# EAGLE schematic Digital-Transmitter (EAGLE 8.5.2)
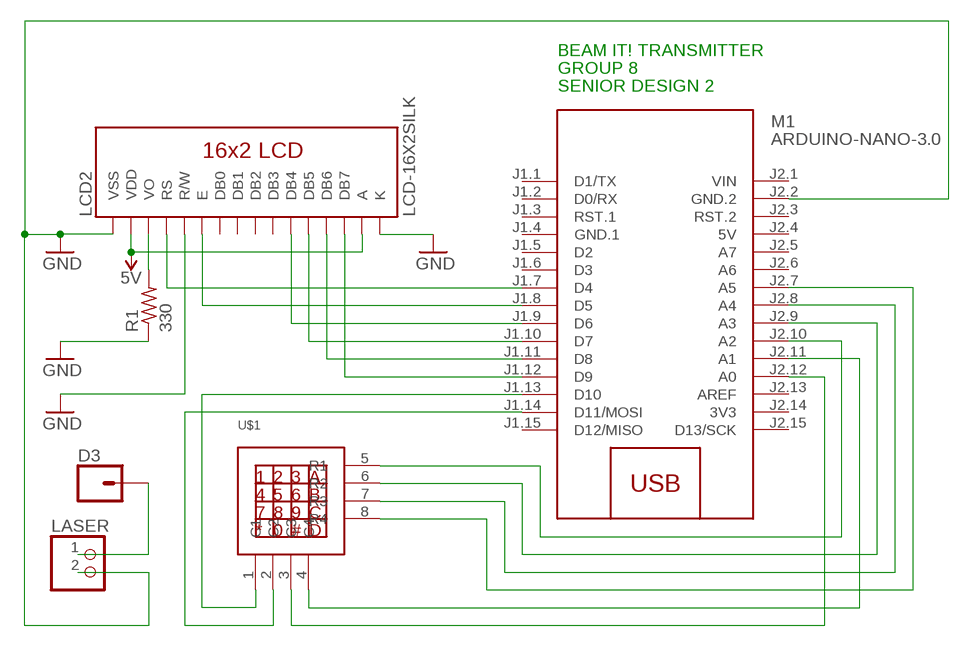
[diagram p0: schematic, sheet 1]

## Parts
D3  CONN_01  [1X01]
LASER  PINHD-1X2  [1X02]
LCD2  LCD-16X2SILK  [LCD-16X2]
M1  ARDUINO-NANO-3.0  [ARDUINO-NANO-3.0]
R1  330  R-US_0204/7  [0204/7]
U$1  KEYPAD4X4  [KEYPAD4X4]

## Nets
5V: LCD2.2(VDD) LCD2.15(A)
GND: LASER.2 LCD2.1(VSS) LCD2.5(R/W) LCD2.16(K) M1.J2.2(GND.2) R1.1
N$1: LCD2.3(VO) R1.2
N$2: LCD2.4(RS) M1.J1.7(D4)
N$3: LCD2.6(E) M1.J1.8(D5)
N$4: LCD2.11(DB4) M1.J1.9(D6)
N$5: LCD2.12(DB5) M1.J1.10(D7)
N$6: LCD2.13(DB6) M1.J1.11(D8)
N$7: LCD2.14(DB7) M1.J1.12(D9)
N$8: M1.J1.13(D10) U$1.1(C1)
N$9: M1.J1.14(D11/MOSI) U$1.2(C2)
N$10: M1.J2.8(A4) U$1.7(R3)
N$11: M1.J2.7(A5) U$1.8(R4)
N$12: M1.J2.11(A1) U$1.4(C4)
N$13: M1.J2.10(A2) U$1.5(R1)
N$14: M1.J2.9(A3) U$1.6(R2)
N$15: M1.J2.12(A0) U$1.3(C3)
N$16: D3.1 LASER.1
Unconnected: LCD2.7(DB0) LCD2.8(DB1) LCD2.9(DB2) LCD2.10(DB3) M1.J1.1(D1/TX) M1.J1.2(D0/RX) M1.J1.3(RST.1) M1.J1.5(D2) M1.J1.6(D3) M1.J1.15(D12/MISO) M1.J2.3(RST.2) M1.J2.5(A7) M1.J2.6(A6) M1.J2.13(AREF) M1.J2.15(D13/SCK)

## Notes on the sheet
- BEAM IT! TRANSMITTER
- GROUP 8
- SENIOR DESIGN 2

## Power pins joined to a net without a drawn wire
3V3: M1.J2.14(3V3)
5V: M1.J2.4(5V)
GND.1: M1.J1.4(GND.1)
VIN: M1.J2.1(VIN)

## Library data of the parts
D3 = SparkFun-Connectors:CONN_01: Single connection point. Often used as Generic Header-pin footprint for 0.1 inch spaced/style header connections On any of the 0.1 inch spaced packages, you can populate with these: Break Away Headers - Straight <https://www.sparkfun.com/products/116> (PRT-00116) Break Away Male Headers - Right Angle <https://www.sparkfun.com/products/553> (PRT-00553) Female Headers <https://www.sparkfun.com/products/115> (PRT-00115) Break Away Headers - Machine Pin <https://www.sparkfun.com/products/117> (PRT-00117) Break Away Female Headers - Swiss Machine Pin <https://www.sparkfun.com/products/743> (PRT-00743) This device is also useful as a general connection point to wire up your design to another part of your project. Our various solder wires solder well into these plated through hole pads. Hook-Up Wire - Assortment (Stranded, 22 AWG) <https://www.sparkfun.com/products/11375> (PRT-11375) Hook-Up Wire - Assortment (Solid Core, 22 AWG) <https://www.sparkfun.com/products/11367> (PRT-11367) View the entire wire category on our website here <https://www.sparkfun.com/categories/141> Special notes: SMTSO-256-ET is a "flush mount" nut for a 4-40 screw. We mostly use this on specialty testbeds; it is a nice way to connect hardware to your PCB at an adjustable hieght. Also note, the SNAP packages are for using a snappable style connector. We sell a baggie of snaps and they are also used on two LilyPad designs: Snap Assortment - 30 pack (male and female) <https://www.sparkfun.com/products/11347> (DEV-11347) LilyPad Arduino SimpleSnap <https://www.sparkfun.com/products/10941> (DEV-10941) LilyPad SimpleSnap Protoboard <https://www.sparkfun.com/products/10940> (DEV-10940)
LASER = DC_LOAD_AU:PINHD-1X2: PIN HEADER
LCD2 = SparkFun-Displays:LCD-16X2: Standard text-only 16x2 parallel input LCD Basic 16 character by 2 line display. Typically utilizes the extremely common HD44780 parallel interface chipset SparkFun Products: Basic 16x2 Green <https://www.sparkfun.com/products/255> Basic 8x2 Green <https://www.sparkfun.com/products/11122>; SF_ID: LCD-00255
M1 = diy-modules:ARDUINO-NANO-3.0: Arduino Nano 3.0 and compatible devices More details available here: https://www.arduino.cc/en/Main/ArduinoBoardNano Click here to find device on ebay.com <http://www.ebay.com/sch/arduino+nano>
R1 = BeagleBone_Black_Wireless:R-US_: RESISTOR, American symbol
U$1 = keypad_4x4_raw:KEYPAD4X4